# EAGLE schematic motor12v (EAGLE 7.2.0)
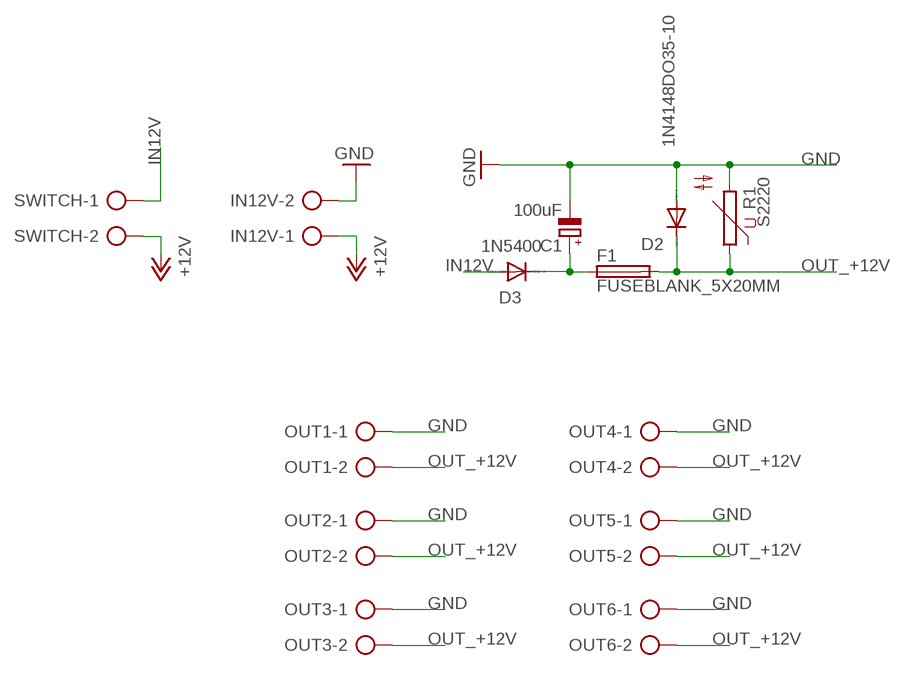
[diagram p0: schematic, sheet 1]

## Parts
C1  100uF  CPOL-EUE3.5-8  [E3,5-8]
D2  1N4148DO35-10  [DO35-10]
D3  1N5400  [DO201-15]
F1  FUSEBLANK_5X20MM  [FUSE_HOLDER_5X20MM]
IN12V  AK500/2  [AK500/2]
OUT1  AK500/2  [AK500/2]
OUT2  AK500/2  [AK500/2]
OUT3  AK500/2  [AK500/2]
OUT4  AK500/2  [AK500/2]
OUT5  AK500/2  [AK500/2]
OUT6  AK500/2  [AK500/2]
R1  S2220  [S2220]
SWITCH  AK500/2  [AK500/2]

## Nets
+12V: IN12V.1 SWITCH.2
EN21: C1.+ D3.C F1.1
GND: C1.- D2.A IN12V.2 OUT1.1 OUT2.1 OUT3.1 OUT4.1 OUT5.1 OUT6.1 R1.2
IN12V: D3.A SWITCH.1
OUT_+12V: D2.C F1.2 OUT1.2 OUT2.2 OUT3.2 OUT4.2 OUT5.2 OUT6.2 R1.1

## Library data of the parts
C1 = resistor:CPOL-EU: POLARIZED CAPACITOR, European symbol
D2 = diode:1N4148: DIODE high speed (Philips)
D3 = diode:1N5400: DIODE standard rectifier, 3 A, 50 V (Motorola)
F1 = fuse:FUSE: Fuse; OC_FARNELL: unknown; OC_NEWARK: unknown
IN12V OUT1-OUT6 SWITCH = con-ptr500:AK500/2: CONNECTOR; OC_FARNELL: unknown; OC_NEWARK: unknown
R1 = varistor:S2220: VARISTOR